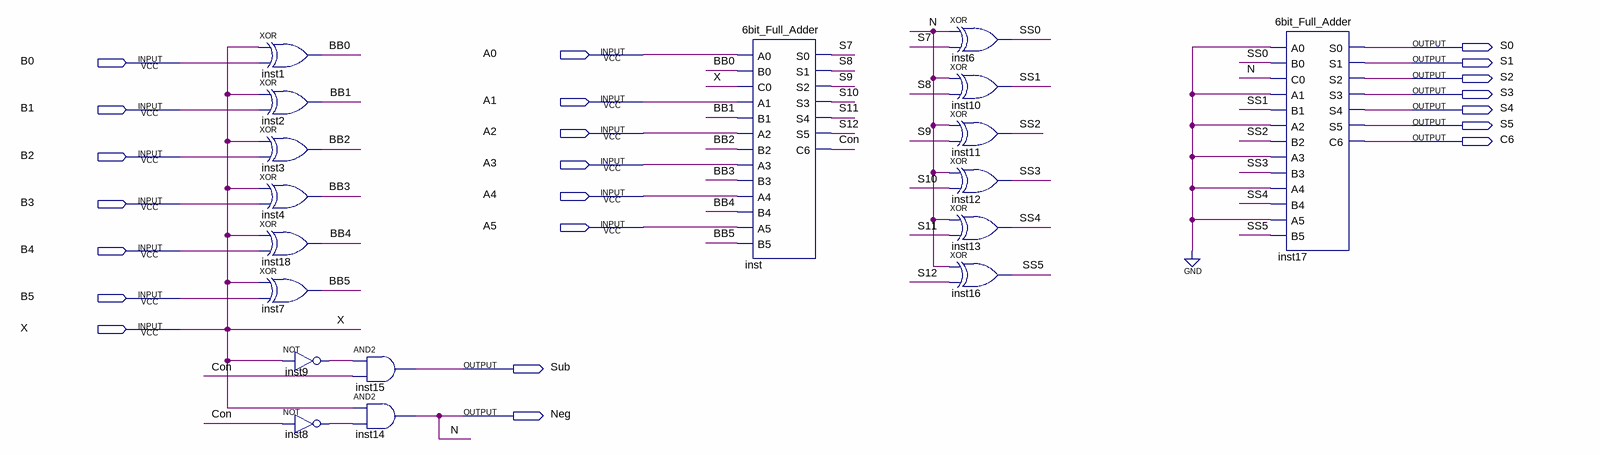
[diagram p0: schematic sheet]
// Quartus schematic FPGA_6bit_Full_Adder_Subtractor.bdf as structural Verilog: 18 symbols, 22 pins
module FPGA_6bit_Full_Adder_Subtractor (
  input  A0,
  input  B0,
  input  A1,
  input  B1,
  input  A2,
  input  B2,
  input  A3,
  input  A4,
  input  B3,
  input  A5,
  input  B4,
  input  B5,
  input  X,
  output S0,
  output S1,
  output S2,
  output S3,
  output S4,
  output S5,
  output C6,
  output Sub,
  output Neg
);

  wire BB0, BB1, BB2, BB3, BB4, BB5, Con, inst8_out, inst9_out, S7, S8, S9, S10, S11, S12, SS0, SS1, SS2,
       SS3, SS4, SS5;

  xor inst1 (BB0, X, B0);
  xor inst2 (BB1, X, B1);
  xor inst3 (BB2, X, B2);
  xor inst4 (BB3, X, B3);
  xor inst18 (BB4, X, B4);
  xor inst7 (BB5, X, B5);
  not inst9 (inst9_out, X);
  not inst8 (inst8_out, Con);
  and inst15 (Sub, inst9_out, Con);
  and inst14 (Neg, X, inst8_out);
  \6bit_Full_Adder  inst (
    .A0(A0), .B0(BB0), .C0(X), .A1(A1), .B1(BB1), .A2(A2), .B2(BB2), .A3(A3), .B3(BB3), .A4(A4), .B4(BB4),
    .A5(A5), .B5(BB5), .S0(S7), .S1(S8), .S2(S9), .S3(S10), .S4(S11), .S5(S12), .C6(Con));
  xor inst6 (SS0, Neg, S7);
  xor inst10 (SS1, Neg, S8);
  xor inst11 (SS2, Neg, S9);
  xor inst12 (SS3, Neg, S10);
  xor inst13 (SS4, Neg, S11);
  xor inst16 (SS5, Neg, S12);
  \6bit_Full_Adder  inst17 (
    .A0(1'b0), .B0(SS0), .C0(Neg), .A1(1'b0), .B1(SS1), .A2(1'b0), .B2(SS2), .A3(1'b0), .B3(SS3), .A4(1'b0),
    .B4(SS4), .A5(1'b0), .B5(SS5), .S0(S0), .S1(S1), .S2(S2), .S3(S3), .S4(S4), .S5(S5), .C6(C6));

  // Other names for the same wires on the sheet: N = Neg
endmodule
